# Altium schematic sheet MCU.SchDoc
size A3; SheetNumber: 1; SheetTotal: 1
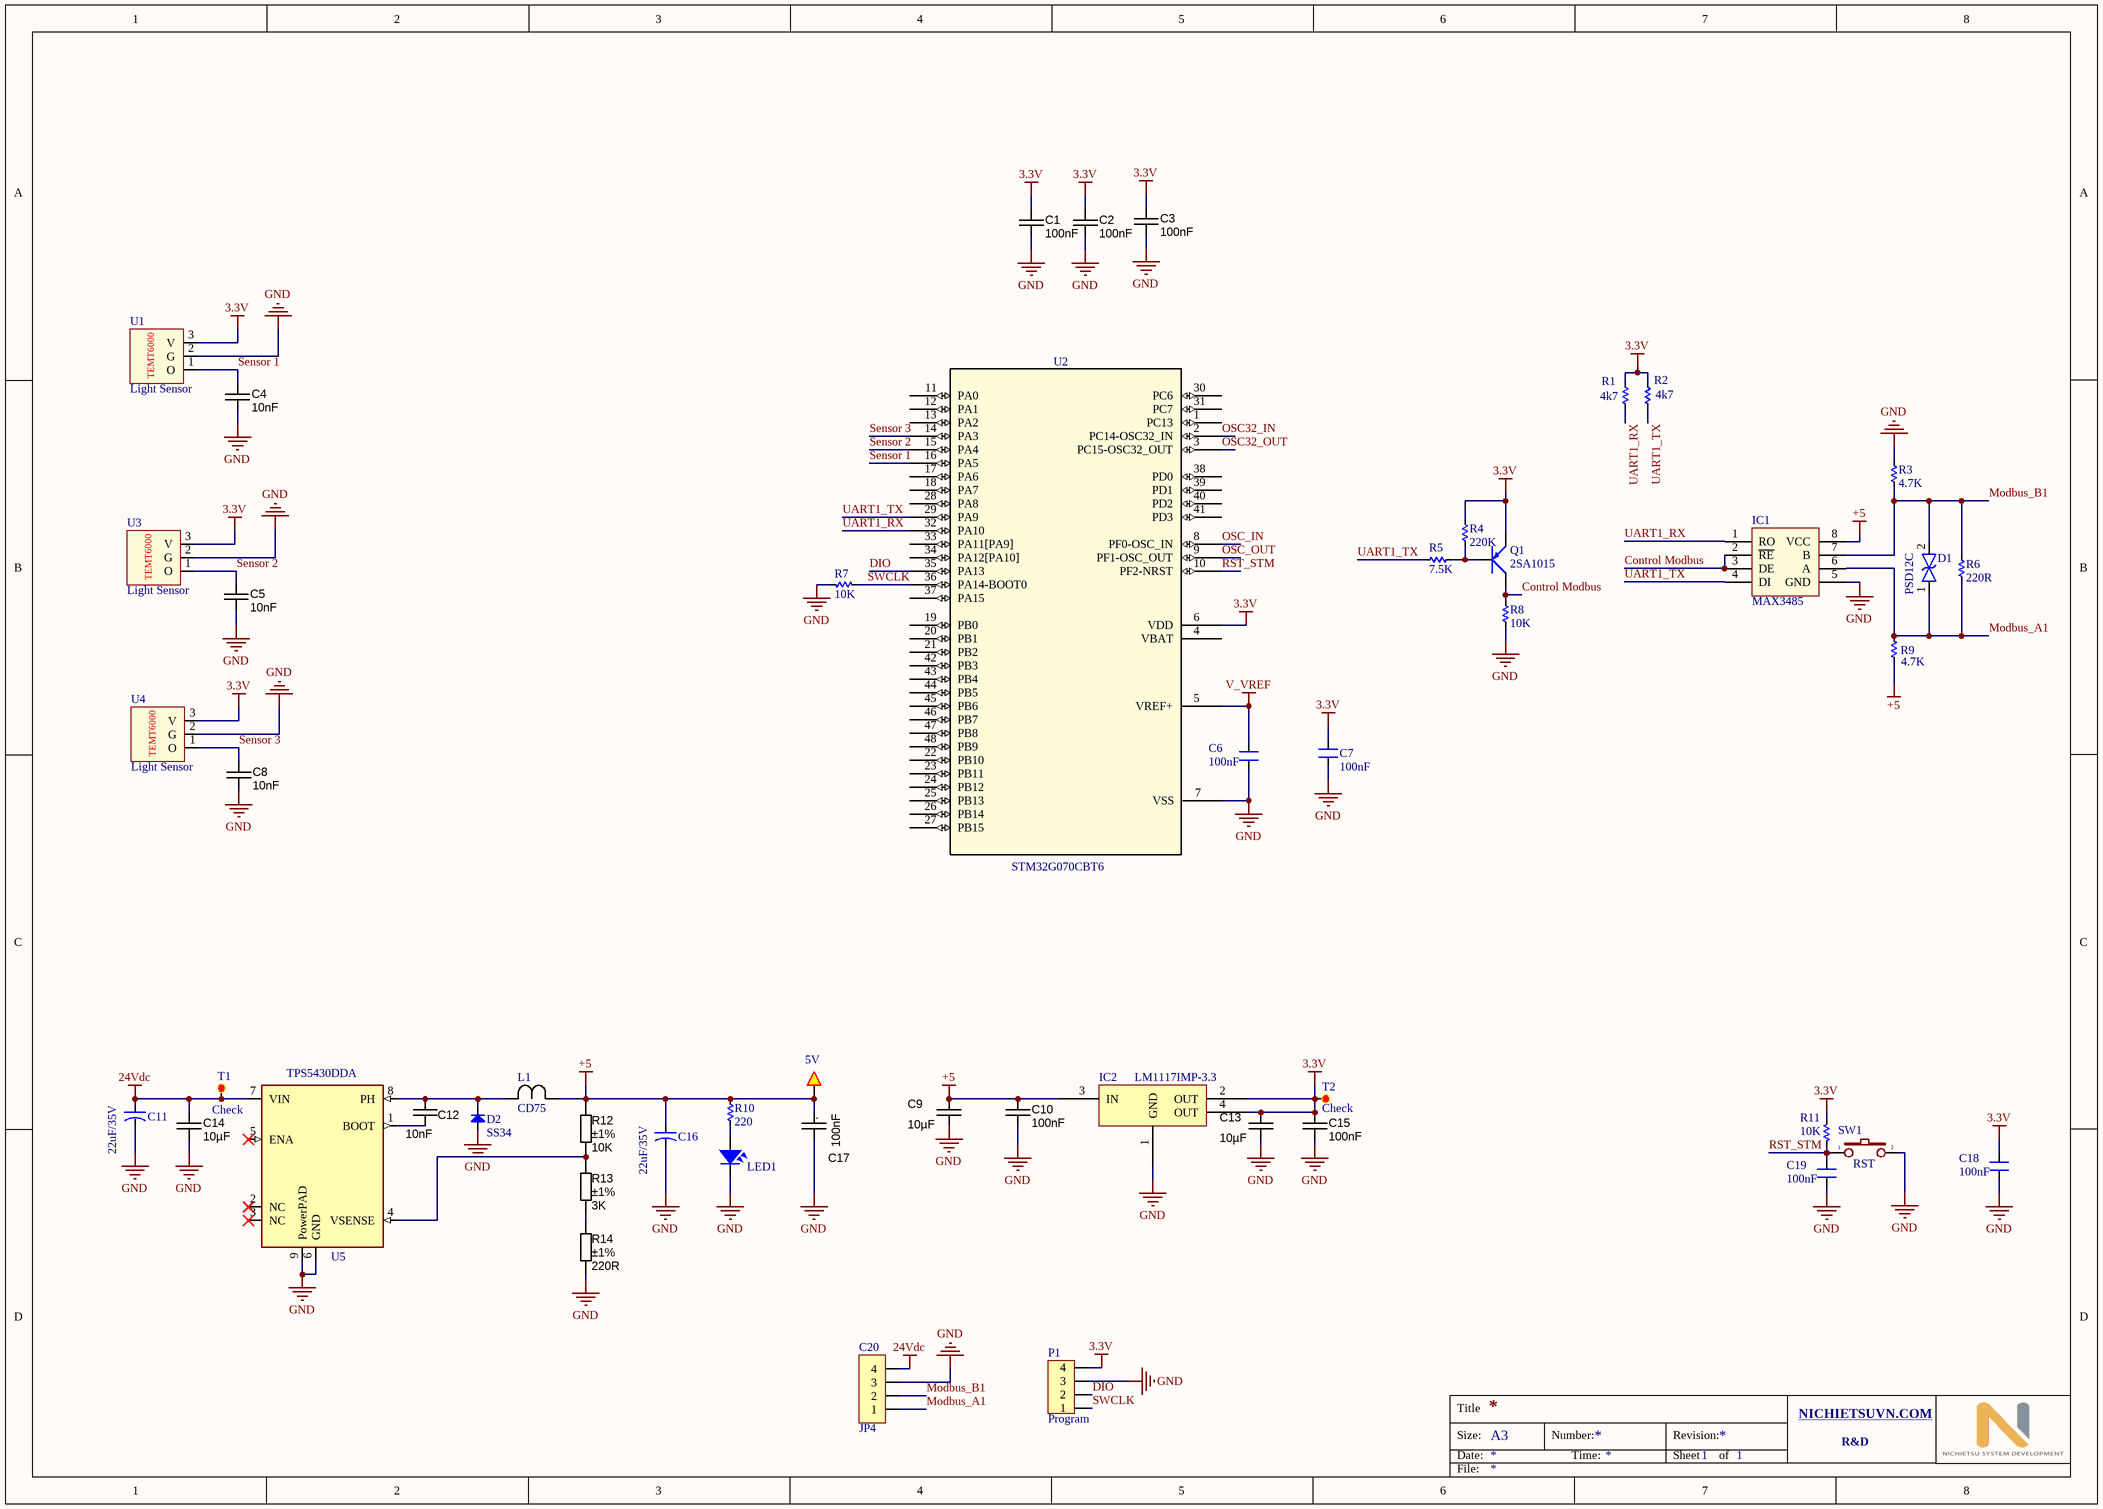
[diagram p0: MCU.SchDoc]

## Parts
C1  100nF  [CAPC1608X90N]
C2  100nF  [CAPC1608X90N]
C3  100nF  [CAPC1608X90N]
C4  10nF  [CAPC1608X90N]
C5  10nF  [CAPC1608X90N]
C6  100nF  [CN-SMD-0603]
C7  100nF  [CN-SMD-0603]
C8  10nF  [CAPC1608X90N]
C9  10µF  [CAPC2012X135N]
C10  100nF  [CAPC1608X90N]
C11  22uF/35V  [CA-ALU-2.54]
C12  10nF  [CAPC1608X90N]
C13  10µF  [CAPC2012X135N]
C14  10µF  [CAPC2012X135N]
C15  100nF  [CAPC1608X90N]
C16  22uF/35V  [CA-ALU-2.54]
C17  100nF  [CAPC2012X135N]
C18  100nF  [CN-SMD-0603]
C19  100nF  [CN-SMD-0603]
C20  JP4  [JP4-D1C]
Check1  5V  [SMD-2]
D1  PSD12C  [PSD12C]
D2  SS34  [DIO-SMD-106]
IC1  MAX3485  [SO8]
IC2  LM1117IMP-3.3  [SOT223]
L1  CD75  [1uH]
LED1  LED  [LED-0805-Blue]  (value not drawn)
P1  Program  [Program_SMD]
Q1  2SA1015  [SOT23-321]
R1  4k7  [RES-SMD-0603]
R2  4k7  [RES-SMD-0603]
R3  4.7K  [RES-SMD-0603]
R4  220K  [RES-SMD-0603]
R5  7.5K  [RES-SMD-0603]
R6  220R  [RES-SMD-0603]
R7  10K  [RES-SMD-0603]
R8  10K  [RES-SMD-0603]
R9  4.7K  [RES-SMD-0603]
R10  220  [RES-SMD-0603]
R11  10K  [RES-SMD-0603]
R12  value 10K  Tolerance: ±1%  [RESC1608X55N]  (hidden comment: 10K_0603_1%)
R13  value 3K  Tolerance: ±1%  [RESC1608X55N]  (hidden comment: 3K_0603_0.5%)
R14  value 220R  Tolerance: ±1%  [RESC1608X55N]  (hidden comment: 220R_0603_1%)
SW1  RST  [SW1-SMD]
T1  Check  [SMD_1.5]
T2  Check  [SMD_1.5]
U1  Light Sensor  [TEMT6000]
U2  STM32G070CBT6  [STM32G070CBT6]
U3  Light Sensor  [TEMT6000]
U4  Light Sensor  [TEMT6000]
U5  TPS5430DDA  [TPS5430]

## Nets
3.3V: C1.1 C2.1 C3.1 C7.1 C13.2 C15.1 C18.1 IC2.2(OUT) IC2.4(OUT) P1.4 Q1.1(E) R1.1 R2.1 R4.2 R11.1 T2.1 U1.3(V) U2.6(VDD) U3.3(V) U4.3(V)
24Vdc: C11.1 C14.2 C20.4 T1.1 U5.7(VIN)
+5: C9.2 C10.1 C16.1 C17.1 Check1.1 IC1.8(VCC) IC2.3(IN) L1.1 R9.1 R10.1 R12.2
GND: C1.2 C2.2 C3.2 C4.2 C5.2 C6.2 C7.2 C8.2 C9.1 C10.2 C11.2 C13.1 C14.1 C15.2 C16.2 C17.2 C18.2 C19.2 C20.3 D2.1(A) IC1.5(GND) IC2.1(GND) LED1.2 P1.3 R3.1 R7.2 R8.1 R14.1 SW1.2 U1.2(G) U2.7(VSS) U3.2(G) U4.2(G) U5.6(GND) U5.9(PowerPAD)
V_VREF: C6.1 U2.5(VREF+)
Control Modbus: IC1.2(~{RE}) IC1.3(DE) Q1.2(C) R8.2
DIO: P1.2 U2.35(PA13)
Modbus_A1: C20.1 D1.1 IC1.6(A) R6.2 R9.2
Modbus_B1: C20.2 D1.2 IC1.7(B) R3.2 R6.1
OSC32_IN: U2.2(PC14-OSC32_IN)
OSC32_OUT: U2.3(PC15-OSC32_OUT)
OSC_IN: U2.8(PF0-OSC_IN)
OSC_OUT: U2.9(PF1-OSC_OUT)
RST_STM: C19.1 R11.2 SW1.1 U2.10(PF2-NRST)
Sensor 1: C4.1 U1.1(O) U2.16(PA5)
Sensor 2: C5.1 U2.15(PA4) U3.1(O)
Sensor 3: C8.1 U2.14(PA3) U4.1(O)
SWCLK: P1.1 R7.1 U2.36(PA14-BOOT0)
UART1_RX: IC1.1(RO) R1.2 U2.32(PA10)
UART1_TX: IC1.4(DI) R2.2 R5.1 U2.29(PA9)
NetC12_1: C12.1 U5.1(BOOT)
NetC12_2: C12.2 D2.2(K) L1.2 U5.8(PH)
NetLED1_1: LED1.1 R10.2
NetQ1_3: Q1.3(B) R4.1 R5.2
NetR12_1: R12.1 R13.2 U5.4(VSENSE)
NetR13_1: R13.1 R14.2

Not connected (* = marked no-connect by the designer): U2 1(PC13) 4(VBAT) 11(PA0) 12(PA1) 13(PA2) 17(PA6) 18(PA7) 19(PB0) 20(PB1) 21(PB2) 22(PB10) 23(PB11) 24(PB12) 25(PB13) 26(PB14) 27(PB15) 28(PA8) 30(PC6) 31(PC7) 33(PA11[PA9]) 34(PA12[PA10]) 37(PA15) 38(PD0) 39(PD1) 40(PD2) 41(PD3) 42(PB3) 43(PB4) 44(PB5) 45(PB6) 46(PB7) 47(PB8) 48(PB9); U5 2(NC)* 3(NC)* 5(ENA)*

## Notes on the sheet
- Title
- Size:
- Date:
- A3
- Number:
- Time:
- Revision:
- Sheet
- of
- NICHIETSUVN.COM <http://NICHIETSUVN.COM>
- R&D
- File:
- (in symbol CAPC_100nF_0805_X7R_50V_10%) .

## Library data of the parts
C1-C5 C8 C10 C15 = CAPC_100nF_0603_X7R_50V_10%: 0.1µF ±10% 50V Ceramic Capacitor X7R 0603 (1608 Metric); Manufacturer 1: TDK Corporation; Manufacturer Part Number 1: CGA3E2X7R1H104K080AA; Pcs 2: 10; Supplier 1: Digi-Key; Supplier Part Number 1: 445-5666-6-ND; Tolerance: ±10%; Operating Temperature: -55°C ~ 125°C; Package / Case: 0603 (1608 Metric); Voltage - Rated: 50V; Ratings: AEC-Q200; Temperature Coefficient: X7R; Applications: Automotive; Packaging: Digi-Reel®; Supplier 2: www.thegioiic.com; Supplier Part Number 2: https://www.thegioiic.com/products/tu-gom-0603-100nf-0-1uf-50v; Price 2: 1800
  C1-C3 C10 C15: Value: 100nF
  C4 C5 C8: Value: 10nF
C6 C7 C18 C19 = CN: Value: 33pF
C9 C13 = CAPC_4.7uF_0805_X7R_50V_10%: 4.7µF ±10% 50V Ceramic Capacitor X7R 0805 (2012 Metric); Manufacturer 1: TDK Corporation; Manufacturer Part Number: CGA4J1X7R1H475K125AE; Pcs 2: 1; Package / Case: 0805 (2012 metric); Tolerance: ±10%; Voltage - Rated: 50V; Temperature Coefficient: X7R; Ratings: AEC-Q200; Operating Temperature: -55°C ~ 125°C; Supplier 1: Digi-Key; Supplier Part Number 1: 445-181410-6-ND; Supplier 2: https://www.thegioiic.com; Supplier Part Number 2: https://www.thegioiic.com/products/tu-gom-0805-4-7uf-50v; Price 2: 680; Value: 10µF
C11 C16 = CN-ALU-DIP: Capacitor (Semiconductor SIM Model); Value: 104; LatestRevisionDate: 17-Jul-2002; LatestRevisionNote: Re-released for DXP Platform.; PackageReference: C1206; Publisher: Altium Limited
C12 = CAPC_10000pF_0603_50V_10%: 10000pF ±10% 50V Ceramic Capacitor X7R 0603 (1608 Metric); Manufacturer 1: TDK Corporation; Manufacturer Part Number 1: CGA3E2X7R1H103K080AA; Pcs 2: 10; Tolerance: ±10%; Operating Temperature: -55°C ~ 125°C; Package / Case: 0603 (1608 Metric); Voltage - Rated: 50V; Ratings: AEC-Q200; Temperature Coefficient: X7R; Supplier Part Number 1: 445-5662-6-ND; Supplier 1: Digi-Key; Supplier 2: https://www.thegioiic.com; Supplier Part Number 2: https://www.thegioiic.com/products/tu-gom-0603-10nf-50v; Price 2: 1900; Value: 10nF
C14 = CAPC_10uF_0805_X7R_25V_10%: 10µF ±10% 25V Ceramic Capacitor X7R 1206 (3216 Metric); Manufacturer 1: Taiyo Yuden; Manufacturer Part Number: TMK316AB7106KLHT; Pcs 2: 10; Supplier 1: Digi-Key; Supplier Part Number 1: 587-3485-6-ND; Tolerance: ±10%; Operating Temperature: -55°C ~ 125°C; Package / Case: 0805 (2012 metric); Voltage - Rated: 25V; Ratings: AEC-Q200; Temperature Coefficient: X7R; Supplier 2: https://www.thegioiic.com; Supplier Part Number 2: https://www.thegioiic.com/products/tu-gom-0805-10uf-25v; Price 2: 5800; Value: 10µF
C17 = CAPC_100nF_0805_X7R_50V_10%: 0.1µF ±10% 50V Ceramic Capacitor X7R 0805 (2012 Metric); Manufacturer 1: Samsung Electro-Mechanics; Manufacturer Part Number: CL21B104KBFXPJE; Pcs 2: 10; Supplier 1: Digi-Key; Supplier Part Number 1: 1276-CL21B104KBFXPJEDKR-ND; Tolerance: ±10%; Operating Temperature: -55°C ~ 125°C; Package / Case: 0805 (2012 metric); Voltage - Rated: 50V; Ratings: AEC-Q200; Temperature Coefficient: X7R; Price 2: 2000; Supplier 2: https://www.thegioiic.com; Supplier Part Number 2: https://www.thegioiic.com/products/tu-gom-0805-100nf-0-1uf-50v; Value: 100nF
C20 = JP4: WR-PHD 2.54 mm Angled Socket Header; Manufacturer: W¨¹rth Elektronik eiSos GmbH; partNo: 613004143121; ComponentLink1 Description: Manufacturer; ComponentLink2 Description: Datasheet; NoPins: 04; Created Date: 29 March 2013; ComponentLink1URL: http://www.we-online.com; ComponentLink2URL: http://katalog.we-online.de/em/datasheet/6130xx143121.pdf; Created by: Karrer Zheng
Check1 T1 T2 = Test: WR-PHD 2.54 mm Angled Socket Header; Manufacturer: W¨¹rth Elektronik eiSos GmbH; partNo: 613002143121; ComponentLink1 Description: Manufacturer; ComponentLink2 Description: Datasheet; NoPins: 02; Created Date: 29 March 2013; ComponentLink1URL: http://www.we-online.com; ComponentLink2URL: http://katalog.we-online.de/em/datasheet/6130xx143121.pdf; Created by: Karrer Zheng
D1 = PSD12C: diode tvs
D2 = Diode SMD: Default Diode; Code - JEDEC: DO-214-AB; Value: 1N5007; Published: 8-Jun-2000; Revision: July-2002: Re-released for DXP Platform.; Publisher: Altium Limited
IC1 = MAX485: RS232 - RS485 (Same sn75176)
IC2 = IC_LM1117IMP-3.3: Linear Voltage Regulator IC  1 Output  800mA SOT-223; Manufacturer: Texas Instruments; Manufacturer Part Number: LM1117IMP-3.3/NOPB; Voltage - Input (Max): 15V; Voltage Dropout (Max): 1.2V @ 800mA; Protection Features: Over Current, Over Temperature; PSRR: 75dB (120Hz); Pcs 2: 1; Supplier 1: Digi-Key; Supplier Part Number 1: LM1117IMP-3.3/NOPBDKR-ND; Current - Output: 800mA; Operating Temperature: -40°C ~ 125°C; Price 2: 11000; Supplier Device Package: SOT-223; Supplier 2: https://www.thegioiic.com; Supplier Part Number 2: https://www.thegioiic.com/products/lm1117imp-3-3-nopb-ic-on-ap-3-3v-800ma
L1 = 1uH: ComponentLink1Description: Buy; ComponentLink1URL: https://www.thegioiic.com/products/cuon-cam-dan-smd-cd43-4532-1r0-1uh-2-7a
LED1 = LED SMD: Value: LED 3 - 5 ly 2 Colour
Q1 = 2SA1015: PNP 600mW, ECB; Value: A1015
R1-R11 = Res-SMD: Resistor; Manufacturer: Generic Components; Class: Passive; Published: 08/06/2000; Publisher: Altium Hobart Technology Centre
R12 = RES_10K_0603_1%: 10 kOhms ±1% 0.1W, 1/10W Chip Resistor 0603 (1608 Metric) Anti-Sulfur, Automotive AEC-Q200, Moisture Resistant Thin Film; Manufacturer: Stackpole Electronics Inc; Manufacturer Part Number: RMCF0603FT10K0; Temperature Coefficient: ±100ppm/°C; Pcs 2: 50; Package / Case: 0603 (1608 Metric); Power (Watts): 1/10W; Supplier 1: Digi-Key; Supplier Part Number 1: RMCF0603FT10K0DKR-ND; Ratings: Automotive AEC-Q200; Operating Temperature: -55°C ~ 155°C; Supplier 2: www.thegioiic.com; Supplier Part Number 2: https://www.thegioiic.com/products/dien-tro-10-kohm-0603-1; Price 2: 2000
R13 = RES_3K_0603_1%: 3 kOhms ±1% 0.1W, 1/10W Chip Resistor 0603 (1608 Metric) Automotive AEC-Q200 Thick Film; Manufacturer: Stackpole Electronics Inc; Manufacturer Part Number: RMCF0603FT3K00; Temperature Coefficient: ±100ppm/°C; Pcs 2: 50; Package / Case: 0603 (1608 Metric); Power (Watts): 1/10W; Supplier 1: Digi-Key; Supplier Part Number 1: RMCF0603FT3K00DKR-ND; Ratings: AEC-Q200; Supplier Part Number 2: https://www.thegioiic.com/products/dien-tro-3-kohm-0603-1; Supplier 2: www.thegioiic.com; Operating Temperature: -55°C ~ 155°C; Price 2: 2000
R14 = RES_220R_0603_1%: 220 Ohms ±1% 0.1W, 1/10W Chip Resistor 0603 (1608 Metric) Automotive AEC-Q200 Thick Film; Manufacturer: Stackpole Electronics Inc; Manufacturer Part Number: RMCF0603FT220R; Temperature Coefficient: ±100ppm/°C; Pcs 2: 50; Package / Case: 0603 (1608 Metric); Ratings: AEC-Q200; Supplier 1: Digi-Key; Supplier Part Number 1: RMCF0603FT220RDKR-ND; Power (Watts): 0.1W, 1/10W; Operating Temperature: -55°C ~ 155°C; Composition: Thick Film; Supplier 2: www.thegioiic.com; Supplier Part Number 2: https://www.thegioiic.com/products/dien-tro-220-ohm-0603-1; Price 2: 2000
SW1 = SW2: Switch button 2 pin; Value: SW chip 2 pin
U1 U3 U4 = TEMT6000: TEMT6000 Analog Light Sensor
U2 = STM32G070CBT6: No Description Available; Vendor: STMicroelectronics; Built_By: EMA_UL_Team; SourceLibrary: Updates_to_database_2020-10-19; Manufacturer_Part_Number: STM32G070CBT6; Copyright: Copyright (C) 2018 Accelerated Designs. All rights reserved; RefDes: RefDes; Type: DEV